# Altium schematic sheet ICS.SchDoc
size A4
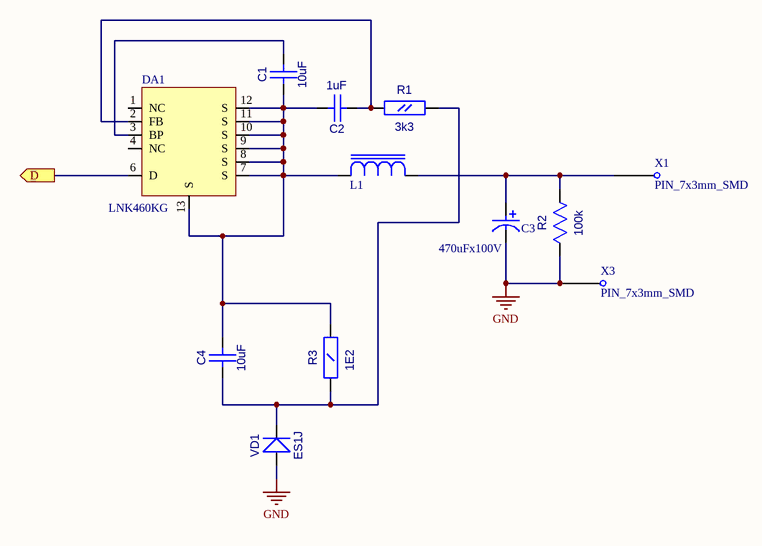
[diagram p0: ICS.SchDoc]

## Parts
C1  10uF  [CC1206]
C2  1uF  [CC0805]
C3  470uFx100V  [CAP_7.5_SMD_2]
C4  10uF  [CC1206]
DA1  LNK460KG  [eSOP-12]
L1  CDRH129HF-331MC  [IND_CDRH129]  (value not drawn)
R1  3k3  [RC0805]
R2  100k  [RC0805]
R3  1E2  [RC1206]
VD1  ES1J  [SMA]
X1  PIN_7x3mm_SMD  [PIN_7x3mm_SMD]
X3  PIN_7x3mm_SMD  [PIN_7x3mm_SMD]

## Ports
D (out)

## Nets
GND: C3.1 R2.1(A) VD1.1(A) X3.1
D: DA1.6(D) ; port D
NetC1_1: C1.1(A) C2.2(B) C4.2(B) DA1.7(S) DA1.8(S) DA1.9(S) DA1.10(S) DA1.11(S) DA1.12(S) DA1.13(S) L1.1(A) R3.2(B)
NetC1_2: C1.2(B) DA1.3(BP)
NetC2_1: C2.1(A) DA1.2(FB) R1.1(A)
NetC3_2: C3.2 L1.2(B) R2.2(B) X1.1
NetC4_1: C4.1(A) R1.2(B) R3.1(A) VD1.2(K)

Not connected (* = marked no-connect by the designer): DA1 1(NC) 4(NC)

## Library data of the parts
C1 C4 = CC1206: Value: 10uF
C2 = CC0805: Value: 1uF
C3 = CAP_16x25: Value: 470uFx100V
L1 = CDRH129: Value: CDRH129HF-331MC
R1 R2 = RC0805
  R1: Value: 3k3
  R2: Value: 100k
R3 = RC1206: Value: 1E2
VD1 = SS14: Schottky Rectifier; Value: ES1J
DA1 = LNK460KG: Value: LNK460KG